# EAGLE schematic Master (EAGLE 6.5.0)

## Sheet 1 of 3
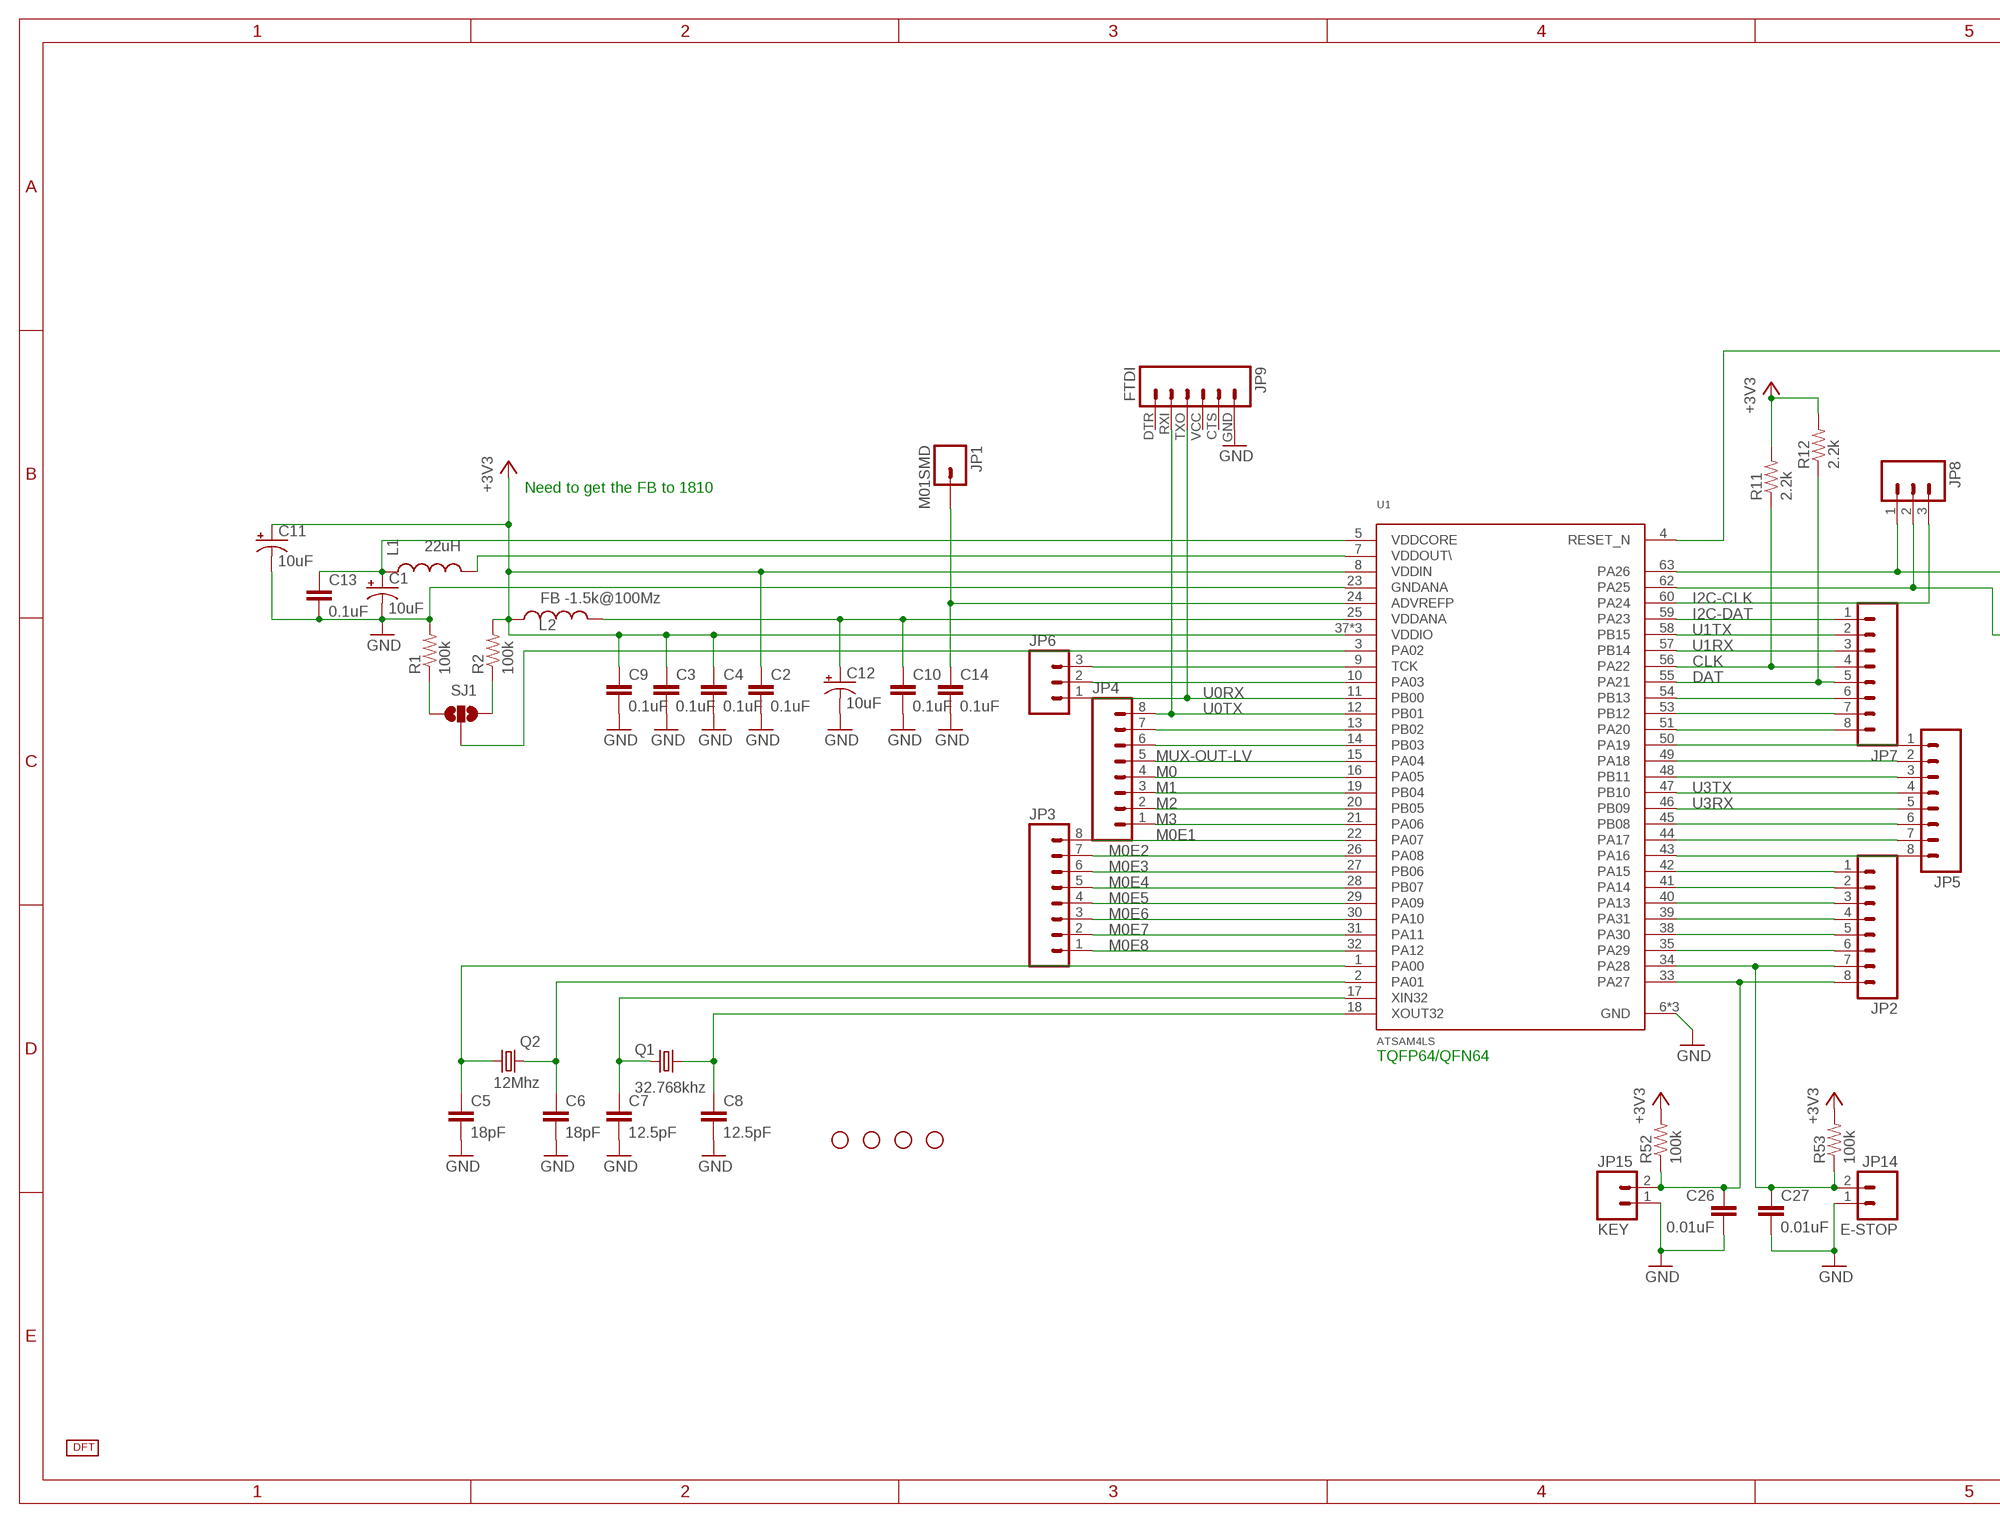
[diagram p0: schematic, sheet 1, part 1 of 2]
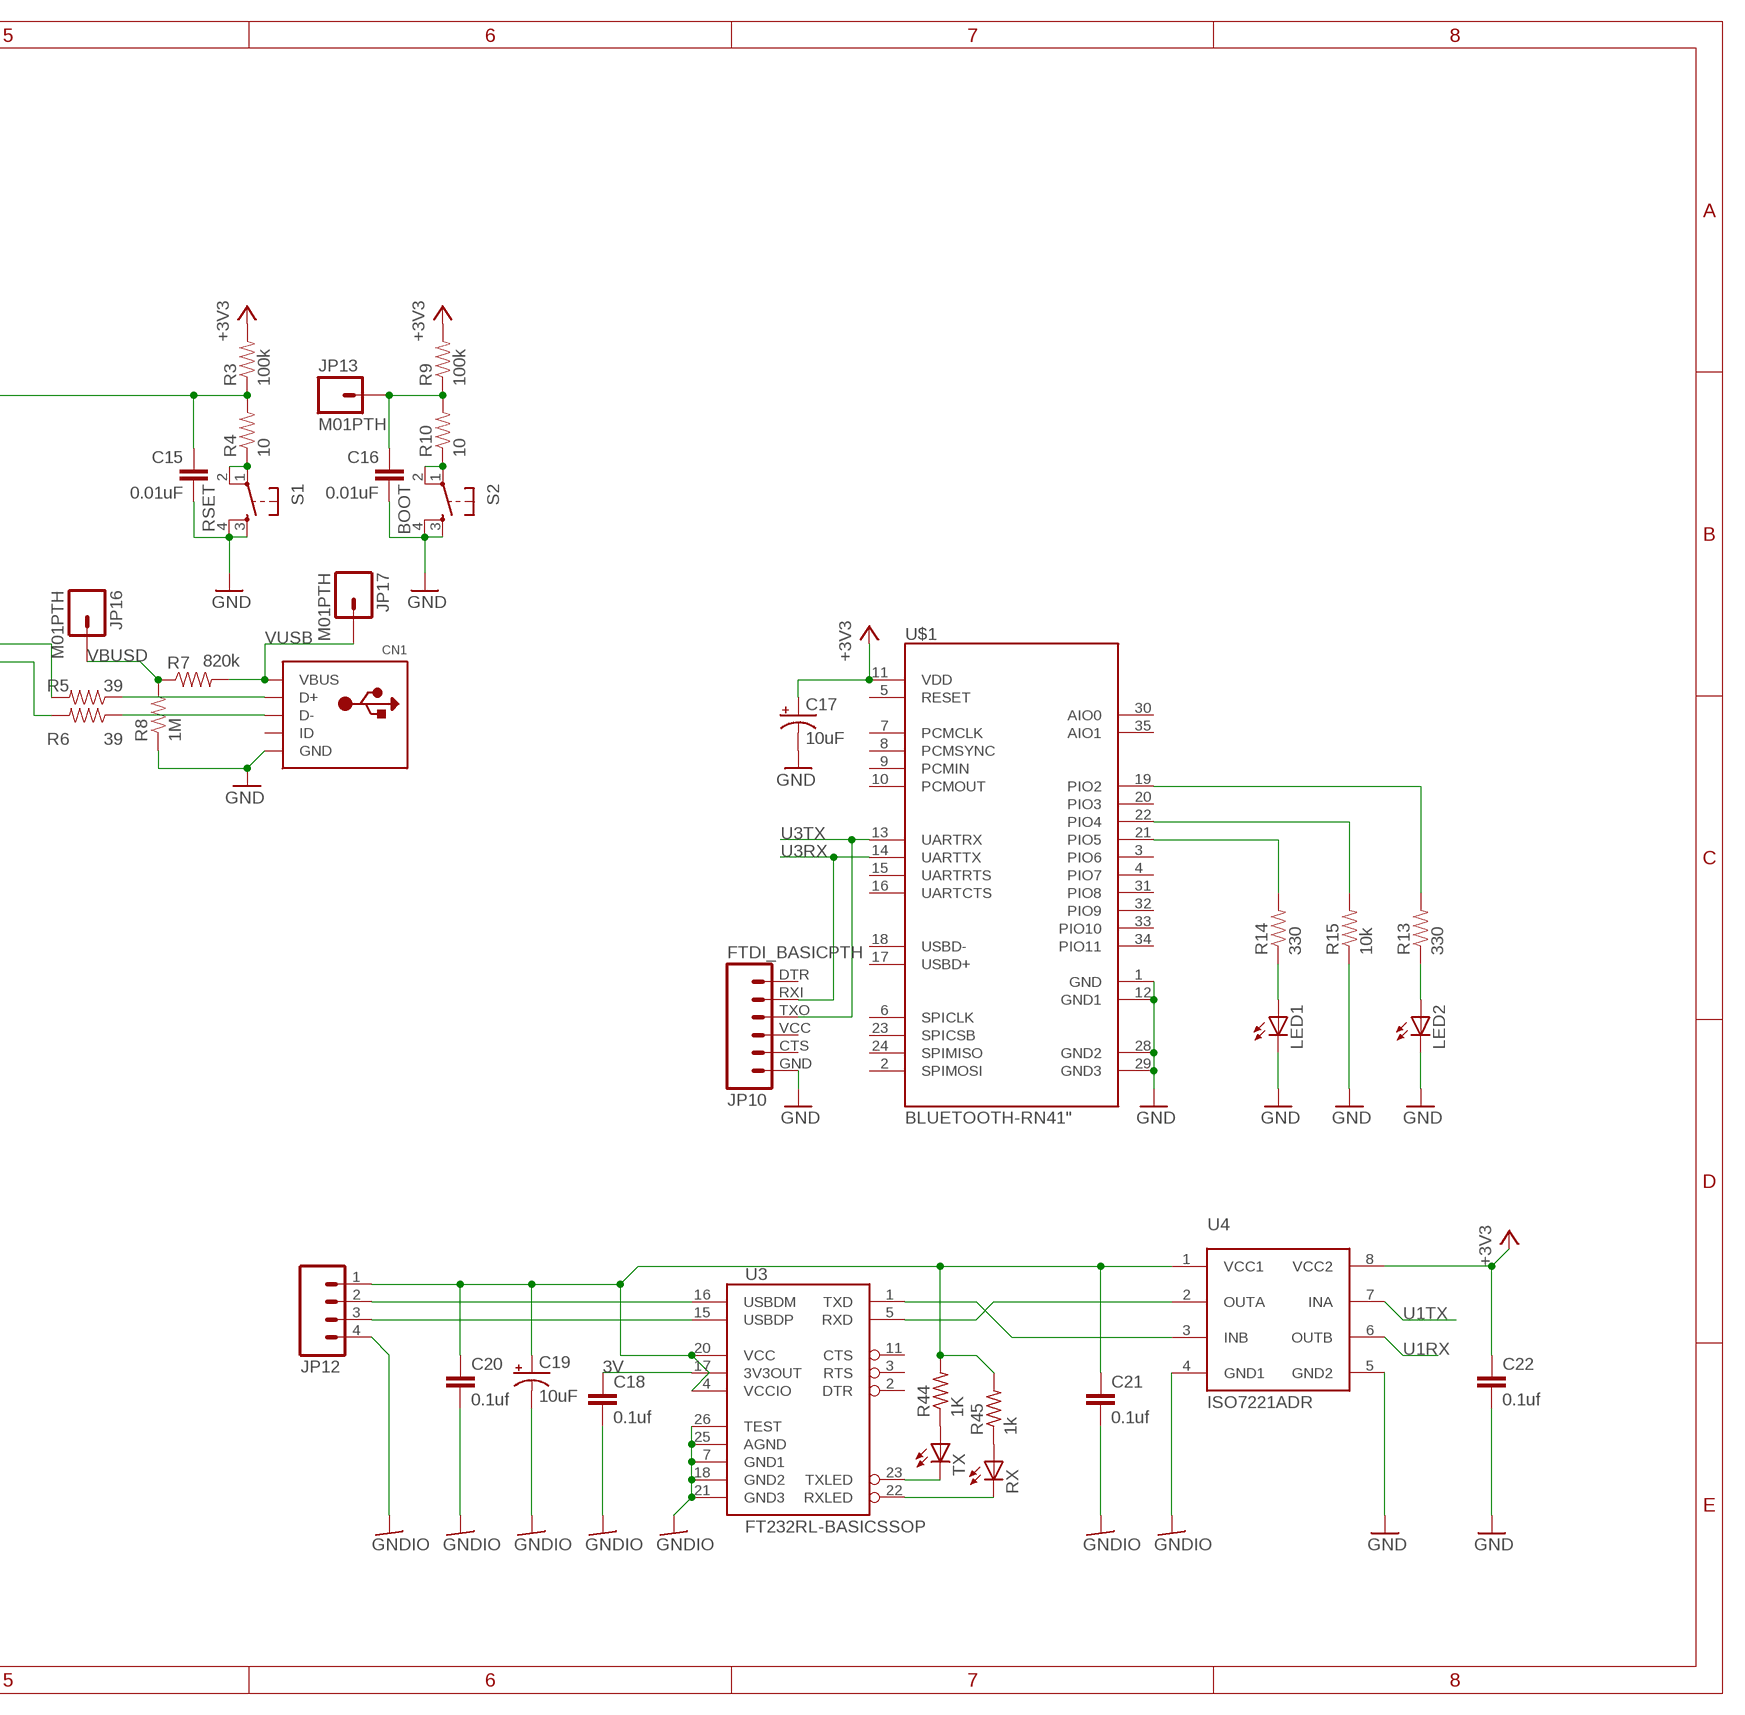
[diagram p1: schematic, sheet 1, part 2 of 2]

### Parts
C1  10uF  CAP_POL1206  [EIA3216]
C2  0.1uF  CAP0805  [0805]
C3  0.1uF  CAP0805  [0805]
C4  0.1uF  CAP0805  [0805]
C5  18pF  CAP0805  [0805]
C6  18pF  CAP0805  [0805]
C7  12.5pF  CAP0805  [0805]
C8  12.5pF  CAP0805  [0805]
C9  0.1uF  CAP0805  [0805]
C10  0.1uF  CAP0805  [0805]
C11  10uF  10UF-16V-10%(TANT)  [EIA3216]
C12  10uF  CAP_POL1206  [EIA3216]
C13  0.1uF  CAP0805  [0805]
C14  0.1uF  CAP0805  [0805]
C15  0.01uF  CAP0805  [0805]
C16  0.01uF  CAP0805  [0805]
C17  10uF  CAP_POL1206  [EIA3216]
C18  0.1uf  CAP0805  [0805]
C19  10uF  CAP_POL1206  [EIA3216]
C20  0.1uf  CAP0805  [0805]
C21  0.1uf  CAP0805  [0805]
C22  0.1uf  CAP0805  [0805]
C26  0.01uF  CAP0805  [0805]
C27  0.01uF  CAP0805  [0805]
CN1  USBMOLEX  [USB-MINIB-THM-MOLEX]
JP1  M01SMD  [LUXEON-PAD]
JP2  M08LOCK  [1X08_LOCK]
JP3  M08LOCK  [1X08_LOCK]
JP4  M08LOCK  [1X08_LOCK]
JP5  M08LOCK  [1X08_LOCK]
JP6  M03LOCK  [1X03_LOCK]
JP7  M08LOCK  [1X08_LOCK]
JP8  M03LOCK  [1X03_LOCK]
JP9  FTDI  FTDI_BASICPTH  [FTDI_BASIC]
JP10  FTDI_BASICPTH  [FTDI_BASIC]
JP12  M04POLAR_LOCK  [MOLEX-1X4_LOCK]
JP13  M01PTH  [1X01]
JP14  E-STOP  M02LOCK  [1X02_LOCK]
JP15  KEY  M02LOCK  [1X02_LOCK]
JP16  M01PTH  [1X01]
JP17  M01PTH  [1X01]
L1  22uH  INDUCTOR0805  [0805]
L2  FB -1.5k@100Mz  INDUCTOR0805  [0805]
LED1  LEDCHIP-LED0805  [CHIP-LED0805]
LED2  LEDCHIP-LED0805  [CHIP-LED0805]
Q1  32.768khz  CRYSTALMM20SS  [MM20SS]
Q2  12Mhz  CRYSTALCTS406  [CTS406]
R1  100k  RESISTOR0805-RES  [0805]
R2  100k  RESISTOR0805-RES  [0805]
R3  100k  RESISTOR0805-RES  [0805]
R4  10  RESISTOR0805-RES  [0805]
R5  39  RESISTOR0805-RES  [0805]
R6  39  RESISTOR0805-RES  [0805]
R7  820k  RESISTOR0805-RES  [0805]
R8  1M  RESISTOR0805-RES  [0805]
R9  100k  RESISTOR0805-RES  [0805]
R10  10  RESISTOR0805-RES  [0805]
R11  2.2k  RESISTOR0805-RES  [0805]
R12  2.2k  RESISTOR0805-RES  [0805]
R13  330  RESISTOR0805-RES  [0805]
R14  330  RESISTOR0805-RES  [0805]
R15  10k  RESISTOR0805-RES  [0805]
R44  1K  R-US_R0805  [R0805]
R45  1k  R-US_R0805  [R0805]
R52  100k  RESISTOR0805-RES  [0805]
R53  100k  RESISTOR0805-RES  [0805]
RX  LEDCHIPLED_0805  [CHIPLED_0805]
S1  RSET  TAC_SWITCHPTH  [TACTILE-PTH]
S2  BOOT  TAC_SWITCHPTH  [TACTILE-PTH]
SJ1  SOLDERJUMPER_2WAYS  [SJ_3]
STANDOFF1  STAND-OFF  [STAND-OFF]
STANDOFF2  STAND-OFF  [STAND-OFF]
STANDOFF3  STAND-OFF  [STAND-OFF]
STANDOFF4  STAND-OFF  [STAND-OFF]
TX  LEDCHIPLED_0805  [CHIPLED_0805]
U1  ATSAM4LS  SAM4L  [TQFP-64]
U3  FT232RL-BASICSSOP  [SSOP28DB]
U4  ISO7221ADR  [SOIC-8]
U$1  BLUETOOTH-RN41"  [RN41]
U$12  LOGO  [LOGO-S]

### Nets
3V: C18.1 U3.17(3V3OUT)
+3V3: C2.1 C3.1 C4.1 C9.1 C11.A(+) C17.A(+) C22.1 L2.1 R2.2 R3.2 R9.2 R11.2 R12.2 R52.2 R53.2 U1.8(VDDIN) U1.37(VDDIO) U1.52(VDDIO) U1.61(VDDIO) U4.8(VCC2) U$1.11(VDD) ; also sheet 2,3
CLK: JP7.4 R11.1 U1.56(PA22)
DAT: JP7.5 R12.1 U1.55(PA21)
GND: C1.C(-) C2.2 C3.2 C4.2 C5.2 C6.2 C7.2 C8.2 C9.2 C10.2 C11.C(-) C12.C(-) C13.2 C14.2 C15.2 C16.2 C17.C(-) C22.2 C26.2 C27.2 CN1.GND JP9.GND JP10.GND JP14.1 JP15.1 LED1.C LED2.C R1.2 R8.1 R15.1 S1.3 S1.4 S2.3 S2.4 U1.6(GND) U1.23(GNDANA) U1.36(GND) U1.64(GND) U4.5(GND2) U$1.1(GND) U$1.12(GND1) U$1.28(GND2) U$1.29(GND3) ; also sheet 2,3
GNDIO: C18.2 C19.C(-) C20.2 C21.2 JP12.4 U3.7(GND1) U3.18(GND2) U3.21(GND3) U3.25(AGND) U3.26(TEST) U4.4(GND1)
I2C-CLK: JP8.3 U1.60(PA24) ; also sheet 2
I2C-DAT: JP7.1 U1.59(PA23) ; also sheet 2
M0: JP4.4 U1.16(PA05) ; also sheet 2
M0E1: JP3.8 U1.22(PA07) ; also sheet 2
M0E2: JP3.7 U1.26(PA08) ; also sheet 2
M0E3: JP3.6 U1.27(PB06) ; also sheet 2
M0E4: JP3.5 U1.28(PB07) ; also sheet 2
M0E5: JP3.4 U1.29(PA09) ; also sheet 2
M0E6: JP3.3 U1.30(PA10) ; also sheet 2
M0E7: JP3.2 U1.31(PA11) ; also sheet 2
M0E8: JP3.1 U1.32(PA12) ; also sheet 2
M1: JP4.3 U1.19(PB04) ; also sheet 2
M2: JP4.2 U1.20(PB05) ; also sheet 2
M3: JP4.1 U1.21(PA06) ; also sheet 2
MUX-OUT-LV: JP4.5 U1.15(PA04) ; also sheet 2
N$1: R4.1 S1.1 S1.2
N$2: L1.2 U1.7(VDDOUT\)
N$3: C1.A(+) C13.1 L1.1 U1.5(VDDCORE)
N$4: C7.1 Q1.1 U1.17(XIN32)
N$5: SJ1.2 U1.3(PA02)
N$6: C8.1 Q1.4 U1.18(XOUT32)
N$7: R1.1 SJ1.3
N$8: C6.1 Q2.1 U1.2(PA01)
N$9: C5.1 Q2.3 U1.1(PA00)
N$10: R2.1 SJ1.1
N$11: C10.1 C12.A(+) L2.2 U1.25(VDDANA)
N$12: C14.1 JP1.P$1 U1.24(ADVREFP)
N$13: C15.1 R3.1 R4.2 U1.4(RESET_N)
N$14: R10.1 S2.1 S2.2
N$15: CN1.D+ R5.1
N$16: CN1.D- R6.1
N$17: C16.1 JP13.1 R9.1 R10.2
N$18: JP8.1 R5.2 U1.63(PA26)
N$19: JP8.2 R6.2 U1.62(PA25)
N$20: LED2.A R13.1
N$21: JP2.1 U1.42(PA15)
N$22: JP2.2 U1.41(PA14)
N$23: JP2.3 U1.40(PA13)
N$24: JP2.4 U1.39(PA31)
N$25: JP2.5 U1.38(PA30)
N$26: JP2.6 U1.35(PA29)
N$28: C26.1 JP2.8 JP15.2 R52.1 U1.33(PA27)
N$32: C27.1 JP2.7 JP14.2 R53.1 U1.34(PA28)
N$33: C19.A(+) C20.1 C21.1 JP12.1 R44.2 R45.2 U3.4(VCCIO) U3.20(VCC) U4.1(VCC1)
N$35: JP12.2 U3.16(USBDM)
N$36: JP12.3 U3.15(USBDP)
N$38: R44.1 TX.A
N$42: JP4.6 U1.14(PB03)
N$43: JP4.7 U1.13(PB02)
N$45: JP5.8 U1.43(PA16)
N$46: JP5.7 U1.44(PA17)
N$47: JP5.6 U1.45(PB08)
N$48: JP5.3 U1.48(PB11)
N$49: JP5.2 U1.49(PA18)
N$50: JP5.1 U1.50(PA19)
N$52: JP6.2 U1.10(PA03)
N$53: JP6.3 U1.9(TCK)
N$54: JP7.8 U1.51(PA20)
N$55: JP7.7 U1.53(PB12)
N$56: JP7.6 U1.54(PB13)
N$59: LED1.A R14.1
N$60: R14.2 U$1.21(PIO5)
N$61: R13.2 U$1.19(PIO2)
N$62: R45.1 RX.A
N$65: R15.2 U$1.22(PIO4)
N$72: TX.C U3.23(TXLED)
N$73: RX.C U3.22(RXLED)
N$82: U3.1(TXD) U4.3(INB)
N$83: U3.5(RXD) U4.2(OUTA)
U0RX: JP6.1 JP9.TXO U1.11(PB00)
U0TX: JP4.8 JP9.RXI U1.12(PB01)
U1RX: JP7.3 U1.57(PB14) U4.6(OUTB)
U1TX: JP7.2 U1.58(PB15) U4.7(INA)
U3RX: JP5.5 JP10.RXI U1.46(PB09) U$1.14(UARTTX)
U3TX: JP5.4 JP10.TXO U1.47(PB10) U$1.13(UARTRX)
VBUSD: JP16.1 R7.1 R8.2
VUSB: CN1.VBUS JP17.1 R7.2
Unconnected: CN1.ID JP9.CTS JP9.DTR JP9.VCC JP10.CTS JP10.DTR JP10.VCC U3.2(DTR) U3.3(RTS) U3.11(CTS) U$1.2(SPIMOSI) U$1.3(PIO6) U$1.4(PIO7) U$1.5(RESET) U$1.6(SPICLK) U$1.7(PCMCLK) U$1.8(PCMSYNC) U$1.9(PCMIN) U$1.10(PCMOUT) U$1.15(UARTRTS) U$1.16(UARTCTS) U$1.17(USBD+) U$1.18(USBD-) U$1.20(PIO3) U$1.23(SPICSB) U$1.24(SPIMISO) U$1.30(AIO0) U$1.31(PIO8) U$1.32(PIO9) U$1.33(PIO10) U$1.34(PIO11) U$1.35(AIO1)

### Notes on the sheet
- Need to get the FB to 1810
- TQFP64/QFN64

## Sheet 2 of 3
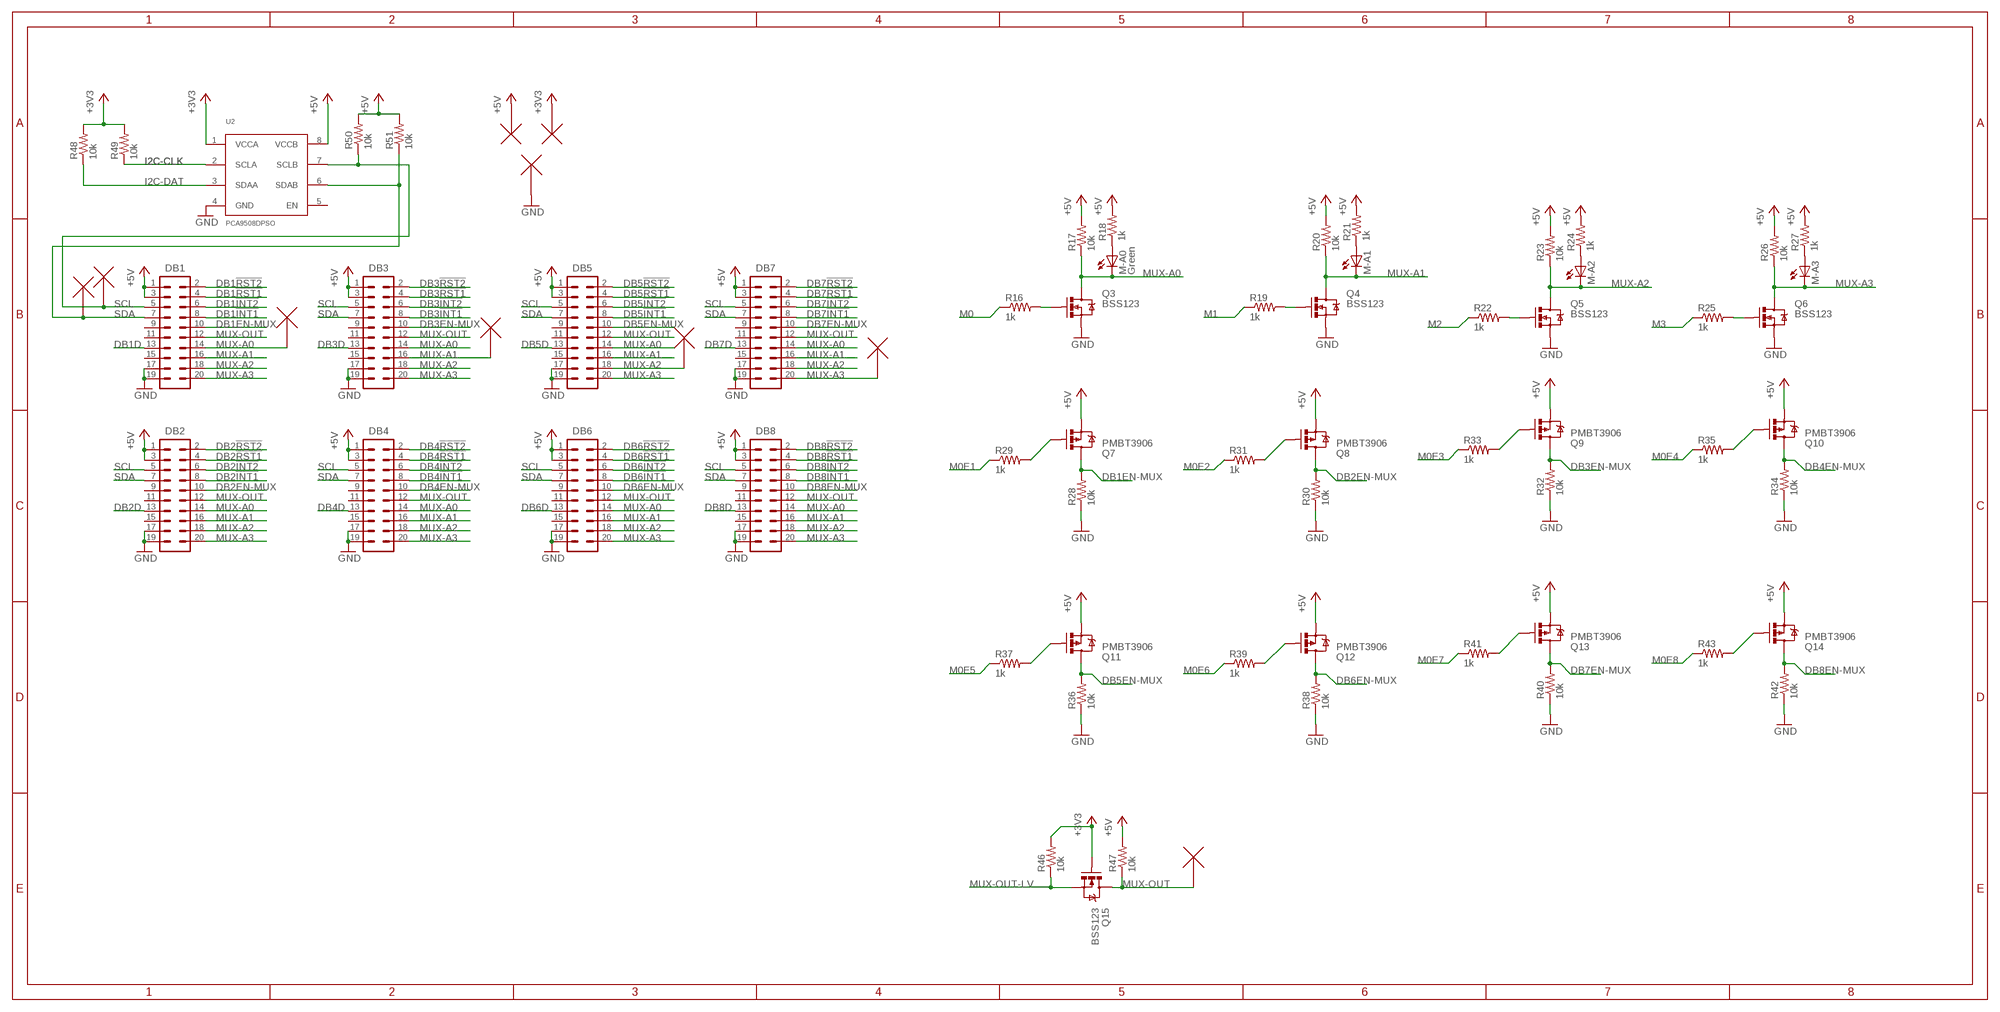
[diagram p2: schematic, sheet 2]

### Parts
DB1  M10X2SPECIAL  [2X10_LOCK_SPECIAL]
DB2  M10X2SPECIAL  [2X10_LOCK_SPECIAL]
DB3  M10X2SPECIAL  [2X10_LOCK_SPECIAL]
DB4  M10X2SPECIAL  [2X10_LOCK_SPECIAL]
DB5  M10X2SPECIAL  [2X10_LOCK_SPECIAL]
DB6  M10X2SPECIAL  [2X10_LOCK_SPECIAL]
DB7  M10X2SPECIAL  [2X10_LOCK_SPECIAL]
DB8  M10X2SPECIAL  [2X10_LOCK_SPECIAL]
M-A0  Green  LEDCHIP-LED0805  [CHIP-LED0805]
M-A1  LEDCHIP-LED0805  [CHIP-LED0805]
M-A2  LEDCHIP-LED0805  [CHIP-LED0805]
M-A3  LEDCHIP-LED0805  [CHIP-LED0805]
Q3  BSS123  MOSFET-NCHANNELBSS123LT1G  [SOT23]
Q4  BSS123  MOSFET-NCHANNELBSS123LT1G  [SOT23]
Q5  BSS123  MOSFET-NCHANNELBSS123LT1G  [SOT23]
Q6  BSS123  MOSFET-NCHANNELBSS123LT1G  [SOT23]
Q7  PMBT3906  MOSFET-PCHANNELSMD  [SOT23-3]
Q8  PMBT3906  MOSFET-PCHANNELSMD  [SOT23-3]
Q9  PMBT3906  MOSFET-PCHANNELSMD  [SOT23-3]
Q10  PMBT3906  MOSFET-PCHANNELSMD  [SOT23-3]
Q11  PMBT3906  MOSFET-PCHANNELSMD  [SOT23-3]
Q12  PMBT3906  MOSFET-PCHANNELSMD  [SOT23-3]
Q13  PMBT3906  MOSFET-PCHANNELSMD  [SOT23-3]
Q14  PMBT3906  MOSFET-PCHANNELSMD  [SOT23-3]
Q15  BSS123  MOSFET-NCHANNELBSS123LT1G  [SOT23]
R16  1k  RESISTOR0805-RES  [0805]
R17  10k  RESISTOR0805-RES  [0805]
R18  1k  RESISTOR0805-RES  [0805]
R19  1k  RESISTOR0805-RES  [0805]
R20  10k  RESISTOR0805-RES  [0805]
R21  1k  RESISTOR0805-RES  [0805]
R22  1k  RESISTOR0805-RES  [0805]
R23  10k  RESISTOR0805-RES  [0805]
R24  1k  RESISTOR0805-RES  [0805]
R25  1k  RESISTOR0805-RES  [0805]
R26  10k  RESISTOR0805-RES  [0805]
R27  1k  RESISTOR0805-RES  [0805]
R28  10k  RESISTOR0805-RES  [0805]
R29  1k  RESISTOR0805-RES  [0805]
R30  10k  RESISTOR0805-RES  [0805]
R31  1k  RESISTOR0805-RES  [0805]
R32  10k  RESISTOR0805-RES  [0805]
R33  1k  RESISTOR0805-RES  [0805]
R34  10k  RESISTOR0805-RES  [0805]
R35  1k  RESISTOR0805-RES  [0805]
R36  10k  RESISTOR0805-RES  [0805]
R37  1k  RESISTOR0805-RES  [0805]
R38  10k  RESISTOR0805-RES  [0805]
R39  1k  RESISTOR0805-RES  [0805]
R40  10k  RESISTOR0805-RES  [0805]
R41  1k  RESISTOR0805-RES  [0805]
R42  10k  RESISTOR0805-RES  [0805]
R43  1k  RESISTOR0805-RES  [0805]
R46  10k  RESISTOR0805-RES  [0805]
R47  10k  RESISTOR0805-RES  [0805]
R48  10k  RESISTOR0805-RES  [0805]
R49  10k  RESISTOR0805-RES  [0805]
R50  10k  RESISTOR0805-RES  [0805]
R51  10k  RESISTOR0805-RES  [0805]
U2  PCA9508DPSO  [SO-8]
U$2  TESTPOINT  [R0603]
U$3  TESTPOINT  [R0603]
U$4  TESTPOINT  [R0603]
U$5  TESTPOINT  [R0603]
U$6  TESTPOINT  [R0603]
U$7  TESTPOINT  [R0603]
U$8  TESTPOINT  [R0603]
U$9  TESTPOINT  [R0603]
U$10  TESTPOINT  [R0603]
U$13  TESTPOINT  [R0603]

### Nets
+3V3: Q15.1(G) R46.2 R48.2 R49.2 U2.1(VCCA) U$9.1 U$9.2 ; also sheet 1,3
+5V: DB1.1 DB1.3 DB2.1 DB2.3 DB3.1 DB3.3 DB4.1 DB4.3 DB5.1 DB5.3 DB6.1 DB6.3 DB7.1 DB7.3 DB8.1 DB8.3 Q7.2(S) Q8.2(S) Q9.2(S) Q10.2(S) Q11.2(S) Q12.2(S) Q13.2(S) Q14.2(S) R17.2 R18.2 R20.2 R21.2 R23.2 R24.2 R26.2 R27.2 R47.2 R50.2 R51.2 U2.8(VCCB) U$8.1 U$8.2 ; also sheet 3
DB1!INT1: DB1.8
DB1!INT2: DB1.6
DB1!RST1: DB1.4
DB1!RST2: DB1.2
DB1D: DB1.13
DB1EN-MUX: DB1.10 Q7.3(D) R28.2
DB2!INT1: DB2.8
DB2!INT2: DB2.6
DB2!RST1: DB2.4
DB2!RST2: DB2.2
DB2D: DB2.13
DB2EN-MUX: DB2.10 Q8.3(D) R30.2
DB3!INT1: DB3.8
DB3!INT2: DB3.6
DB3!RST1: DB3.4
DB3!RST2: DB3.2
DB3D: DB3.13
DB3EN-MUX: DB3.10 Q9.3(D) R32.2
DB4!INT1: DB4.8
DB4!INT2: DB4.6
DB4!RST1: DB4.4
DB4!RST2: DB4.2
DB4D: DB4.13
DB4EN-MUX: DB4.10 Q10.3(D) R34.2
DB5!INT1: DB5.8
DB5!INT2: DB5.6
DB5!RST1: DB5.4
DB5!RST2: DB5.2
DB5D: DB5.13
DB5EN-MUX: DB5.10 Q11.3(D) R36.2
DB6!INT1: DB6.8
DB6!INT2: DB6.6
DB6!RST1: DB6.4
DB6!RST2: DB6.2
DB6D: DB6.13
DB6EN-MUX: DB6.10 Q12.3(D) R38.2
DB7!INT1: DB7.8
DB7!INT2: DB7.6
DB7!RST1: DB7.4
DB7!RST2: DB7.2
DB7D: DB7.13
DB7EN-MUX: DB7.10 Q13.3(D) R40.2
DB8!INT1: DB8.8
DB8!INT2: DB8.6
DB8!RST1: DB8.4
DB8!RST2: DB8.2
DB8D: DB8.13
DB8EN-MUX: DB8.10 Q14.3(D) R42.2
GND: DB1.17 DB1.19 DB2.17 DB2.19 DB3.17 DB3.19 DB4.17 DB4.19 DB5.17 DB5.19 DB6.17 DB6.19 DB7.17 DB7.19 DB8.17 DB8.19 Q3.2(S) Q4.2(S) Q5.2(S) Q6.2(S) R28.1 R30.1 R32.1 R34.1 R36.1 R38.1 R40.1 R42.1 U2.4(GND) U$10.1 U$10.2 ; also sheet 1,3
I2C-CLK: R49.1 U2.2(SCLA) ; also sheet 1
I2C-DAT: R48.1 U2.3(SDAA) ; also sheet 1
M0: R16.1 ; also sheet 1
M0E1: R29.1 ; also sheet 1
M0E2: R31.1 ; also sheet 1
M0E3: R33.1 ; also sheet 1
M0E4: R35.1 ; also sheet 1
M0E5: R37.1 ; also sheet 1
M0E6: R39.1 ; also sheet 1
M0E7: R41.1 ; also sheet 1
M0E8: R43.1 ; also sheet 1
M1: R19.1 ; also sheet 1
M2: R22.1 ; also sheet 1
M3: R25.1 ; also sheet 1
MUX-A0: DB1.14 DB2.14 DB3.14 DB4.14 DB5.14 DB6.14 DB7.14 DB8.14 M-A0.C Q3.3(D) R17.1 U$4.1 U$4.2
MUX-A1: DB1.16 DB2.16 DB3.16 DB4.16 DB5.16 DB6.16 DB7.16 DB8.16 M-A1.C Q4.3(D) R20.1 U$5.1 U$5.2
MUX-A2: DB1.18 DB2.18 DB3.18 DB4.18 DB5.18 DB6.18 DB7.18 DB8.18 M-A2.C Q5.3(D) R23.1 U$6.1 U$6.2
MUX-A3: DB1.20 DB2.20 DB3.20 DB4.20 DB5.20 DB6.20 DB7.20 DB8.20 M-A3.C Q6.3(D) R26.1 U$7.1 U$7.2
MUX-OUT: DB1.12 DB2.12 DB3.12 DB4.12 DB5.12 DB6.12 DB7.12 DB8.12 Q15.3(D) R47.1 U$13.1 U$13.2
MUX-OUT-LV: Q15.2(S) R46.1 ; also sheet 1
N$63: Q3.1(G) R16.2
N$64: M-A0.A R18.1
N$66: Q4.1(G) R19.2
N$67: M-A1.A R21.1
N$68: Q5.1(G) R22.2
N$69: M-A2.A R24.1
N$70: Q6.1(G) R25.2
N$71: M-A3.A R27.1
N$74: Q8.1(G) R31.2
N$75: Q7.1(G) R29.2
N$76: Q9.1(G) R33.2
N$77: Q10.1(G) R35.2
N$78: Q11.1(G) R37.2
N$79: Q12.1(G) R39.2
N$80: Q13.1(G) R41.2
N$81: Q14.1(G) R43.2
SCL: DB1.5 DB2.5 DB3.5 DB4.5 DB5.5 DB6.5 DB7.5 DB8.5 R50.1 U2.7(SCLB) U$2.1 U$2.2
SDA: DB1.7 DB2.7 DB3.7 DB4.7 DB5.7 DB6.7 DB7.7 DB8.7 R51.1 U2.6(SDAB) U$3.1 U$3.2
Unconnected: DB1.9 DB1.11 DB1.15 DB2.9 DB2.11 DB2.15 DB3.9 DB3.11 DB3.15 DB4.9 DB4.11 DB4.15 DB5.9 DB5.11 DB5.15 DB6.9 DB6.11 DB6.15 DB7.9 DB7.11 DB7.15 DB8.9 DB8.11 DB8.15 U2.5(EN)

## Sheet 3 of 3
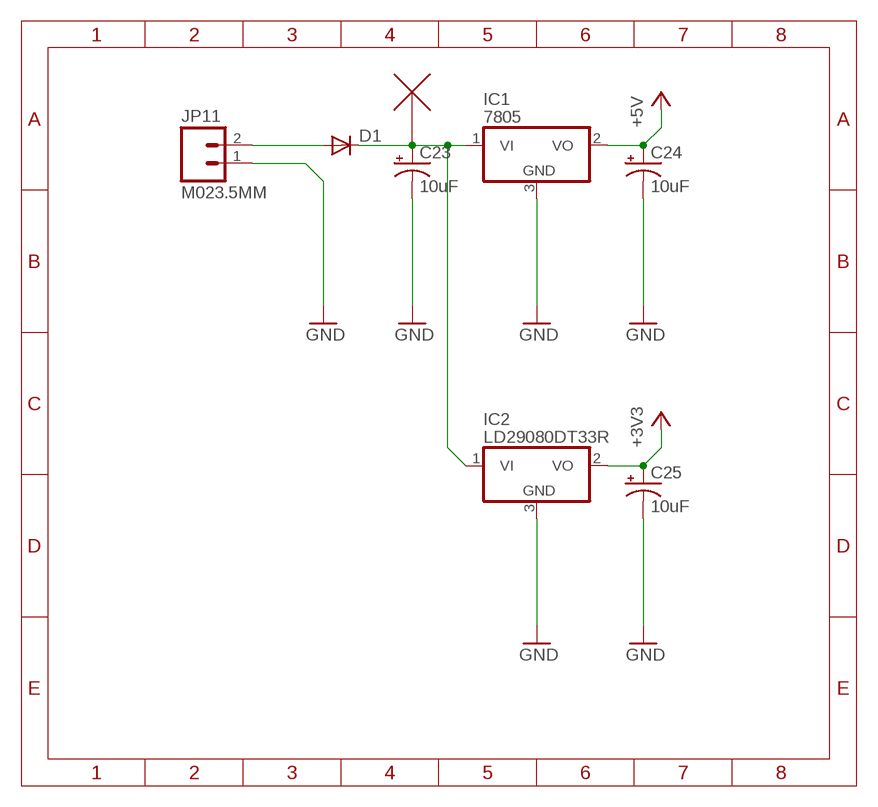
[diagram p3: schematic, sheet 3]

### Parts
C23  10uF  CAP_POL6032  [EIA6032]
C24  10uF  10UF-TANT  [EIA3216]
C25  10uF  10UF-TANT  [EIA3216]
D1  DIODESMA  [SMA-DIODE]
IC1  7805  7806DT  [TO252]
IC2  LD29080DT33R  7806DT  [TO252]
JP11  M023.5MM  [SCREWTERMINAL-3.5MM-2]
U$11  TESTPOINT  [R0603]

### Nets
+3V3: C25.A(+) IC2.2(VO) ; also sheet 1,2
+5V: C24.A(+) IC1.2(VO) ; also sheet 2
GND: C23.P$2(-) C24.C(-) C25.C(-) IC1.3(GND) IC2.3(GND) JP11.1 ; also sheet 1,2
N$30: C23.P$1(+) D1.C IC1.1(VI) IC2.1(VI) U$11.1 U$11.2
N$31: D1.A JP11.2

## Library data of the parts
C1 C12 C17 C23 = SparkFun-Passives:CAP_POL: Capacitor Polarized These are standard SMD and PTH capacitors. Normally 10uF, 47uF, and 100uF in electrolytic and tantalum varieties. Always verify the external diameter of the through hole cap, it varies with capacity, voltage, and manufacturer. The EIA devices should be standard.
C2-C10 C13-C16 C26 C27 = SparkFun-Passives:CAP: Capacitor Standard 0603 ceramic capacitor, and 0.1" leaded capacitor.
C11 = SparkFun-Capacitors:10UF-16V-10%(TANT): CAP-00811 1206/EIA-3216 Tantalum capacitor; PROD_ID: CAP-00811
C18 C20-C22 = SparkFun:CAP: Capacitor Standard 0603 ceramic capacitor, and 0.1" leaded capacitor.
C19 = SparkFun:CAP_POL: Capacitor Polarized These are standard SMD and PTH capacitors. Normally 10uF, 47uF, and 100uF in electrolytic and tantalum varieties. Always verify the external diameter of the through hole cap, it varies with capacity, voltage, and manufacturer. The EIA devices should be standard.
C24 C25 = SparkFun-Capacitors:10UF-TANT: 10uF Tantalum SMT CAP-00811- 16V 10% (EIA-3216); PROD_ID: CAP-00811
CN1 = adafruit:USB: USB Connectors USBMINIB - Surface Mount Female Mini-B USB Connector 4UConnector: 06564 By microbuilder.eu Thru-hole RA Female Mini-B USB Connector 4UConnector: 18732 By ladyada.net
D1 = SparkFun-DiscreteSemi:DIODE: Diode These are standard reverse protection diodes and small signal diodes. SMA package can handle up to about 1A. SOD-323 can handle about 200mA. What the SOD-323 package when ordering, there are some mfgs out there that are 5-pin packages.
DB1-DB8 = SparkFun-Connectors:M10X2: This was SPECIALLY designed to be used with our Graphic LCD Backpack. Be sure you want to use this! It is not only staggered on each line of header holes, but IT IS ALSO offset of the center point of the top and bottom lines by 5 mil. This causes the headers to lock into place on the "standard" footprint on the LCD screen. The extra squares on the tdocu layer are there simply to reference other pins (if you were to actually populate a longer header than ten long - this is what we do with the backpacks).
IC1 IC2 = adafruit:78*: Positive VOLTAGE REGULATOR Added bigger pads to the TO-92 package
JP1 JP13 JP16 JP17 = SparkFun-Connectors:M01: Header 1 Standard 1-pin 0.1" header. Use with straight break away headers (SKU : PRT-00116), right angle break away headers (PRT-00553), swiss pins (PRT-00743), machine pins (PRT-00117), and female headers (PRT-00115).
JP2-JP5 JP7 = SparkFun-Connectors:M08: Header 8 Standard 8-pin 0.1" header. Use with straight break away headers (SKU : PRT-00116), right angle break away headers (PRT-00553), swiss pins (PRT-00743), machine pins (PRT-00117), and female headers (PRT-00115).
JP6 JP8 = SparkFun-Connectors:M03: Header 3 Standard 3-pin 0.1" header. Use with straight break away headers (SKU : PRT-00116), right angle break away headers (PRT-00553), swiss pins (PRT-00743), machine pins (PRT-00117), and female headers (PRT-00115). Molex polarized connector foot print use with SKU : PRT-08232 with associated crimp pins and housings.
JP9 JP10 = SparkFun-Connectors:FTDI_BASIC: FTDI Basic header with labels
JP11 JP14 JP15 = SparkFun-Connectors:M02: Standard 2-pin 0.1" header. Use with - straight break away headers ( PRT-00116) - right angle break away headers (PRT-00553) - swiss pins (PRT-00743) - machine pins (PRT-00117) - female headers (PRT-00115) Molex polarized connector foot print use with: PRT-08233 with associated crimp pins and housings. 2.54_SCREWTERM for use with PRT-10571. 3.5mm Screw Terminal footprints for PRT-08084 5mm Screw Terminal footprints for use with PRT-08433
JP12 = SparkFun-Connectors:M04: Header 4 Standard 4-pin 0.1" header. Use with straight break away headers (SKU : PRT-00116), right angle break away headers (PRT-00553), swiss pins (PRT-00743), machine pins (PRT-00117), and female headers (PRT-00115). Molex polarized connector foot print use with SKU : PRT-08231 with associated crimp pins and housings. 1MM SMD Version SKU: PRT-10208
L1 L2 = SparkFun-Passives:INDUCTOR: Inductors Basic Inductor/Choke - 0603 and 1206. Footprints are not proven and vary greatly between part numbers. SRN6045- 33uH, 20% 1.4A
LED1 LED2 M-A0 M-A1-M-A3 RX TX = adafruit:LED: LED OSRAM: - CHIPLED LG R971, LG N971, LY N971, LG Q971, LY Q971, LO R971, LY R971 LH N974, LH R974 LS Q976, LO Q976, LY Q976 LO Q996 - Hyper CHIPLED LW Q18S LB Q993, LB Q99A, LB R99A - SideLED LS A670, LO A670, LY A670, LG A670, LP A670 LB A673, LV A673, LT A673, LW A673 LH A674 LY A675 LS A676, LA A676, LO A676, LY A676, LW A676 LS A679, LY A679, LG A679 - Hyper Micro SIDELED® LS Y876, LA Y876, LO Y876, LY Y876 LT Y87S - SmartLED LW L88C, LW L88S LB L89C, LB L89S, LG L890 LS L89K, LO L89K, LY L89K LS L896, LA L896, LO L896, LY L896 - TOPLED LS T670, LO T670, LY T670, LG T670, LP T670 LSG T670, LSP T670, LSY T670, LOP T670, LYG T670 LG T671, LOG T671, LSG T671 LB T673, LV T673, LT T673, LW T673 LH T674 LS T676, LA T676, LO T676, LY T676, LB T676, LH T676, LSB T676, LW T676 LB T67C, LV T67C, LT T67C, LS T67K, LO T67K, LY T67K, LW E67C LS E67B, LA E67B, LO E67B, LY E67B, LB E67C, LV E67C, LT E67C LW T67C LS T679, LY T679, LG T679 LS T770, LO T770, LY T770, LG T770, LP T770 LB T773, LV T773, LT T773, LW T773 LH T774 LS E675, LA E675, LY E675, LS T675 LS T776, LA T776, LO T776, LY T776, LB T776 LHGB T686 LT T68C, LB T68C - Hyper Mini TOPLED® LB M676 - Mini TOPLED Santana® LG M470 LS M47K, LO M47K, LY M47K Source: http://www.osram.convergy.de/
Q1 Q2 = adafruit:CRYSTAL: CRYSTAL; OC_FARNELL: unknown; OC_NEWARK: unknown
Q3-Q6 Q15 = SparkFun-DiscreteSemi:MOSFET-NCHANNEL: Common NMOSFET Parts MFG P/N Store ID Prod ID FDD8780 TRANS-09984 SI7820DN TRANS-11055 FDS6630A IC-08089 2N7002PW TRANS-11151 FQP30N06L COM-10213 TRANS-10060 BSS123LT1G TRANS-08345 BSS138 TRANS-00830 BS170 2N7000; PROD_ID: TRANS-08345
Q7-Q14 = SparkFun-DiscreteSemi:MOSFET-PCHANNEL: Generic PMOSFET
R1-R43 R46-R53 = SparkFun-Passives:RESISTOR: Resistor Basic schematic elements and footprints for 0603, 1206, and PTH resistors.
R44 R45 = adafruit:R-US_: RESISTOR, American symbol
S1 S2 = SparkFun-Electromechanical:TAC_SWITCH: Momentary Switch Button commonly used for reset or general input. Spark Fun Electronics SKU : COM-00097 SMT- SWCH-08247
SJ1 = SparkFun-Passives:SOLDERJUMPER_2WAY: Solder Jumper 2 way solder jumper
STANDOFF1-STANDOFF4 = SparkFun-Electromechanical:STAND-OFF: #4 Stand Off This is the mechanical footprint for a #4 phillips button head screw. Use the keepout ring to avoid running the screw head into surrounding components. SKU : PRT-00447
U1 = DFT2:SAM4L
U2 = DFT2:PCA9508DP
U3 = SparkFun:FT232RL-BASIC: USB UART This is the simplified version of the FT232RL unit. Only what you need, nothing you don't. Spark Fun Electronics SKU : COM-00650
U4 = Gasbarre:ISO7221ADR
U$1 = SparkFun-RF:BLUETOOTH-RN41: Bluetooth SMD module
U$2-U$11 U$13 = DFT2:TESTPOINT
U$12 = DFT_Logo:LOGO